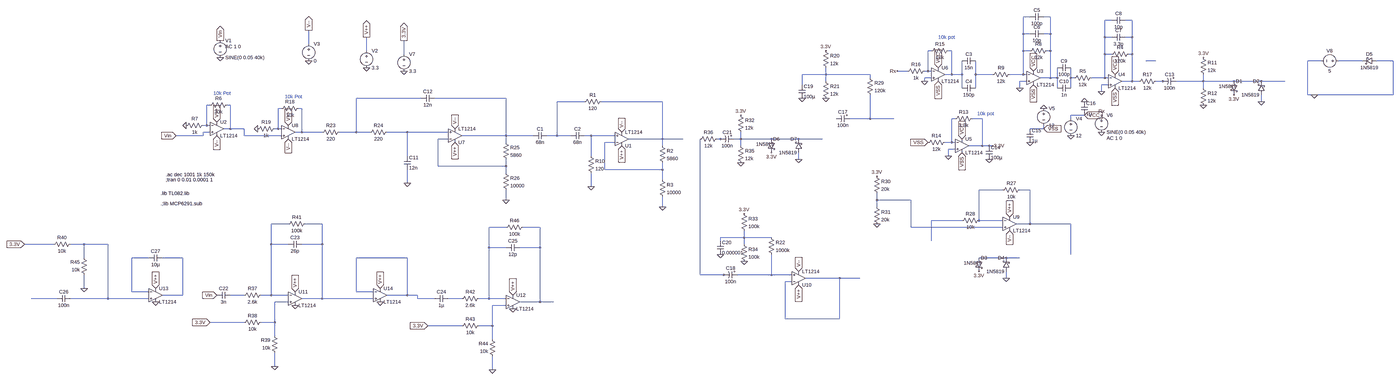
[diagram p0: schematic RxNew1.asc, whole sheet]
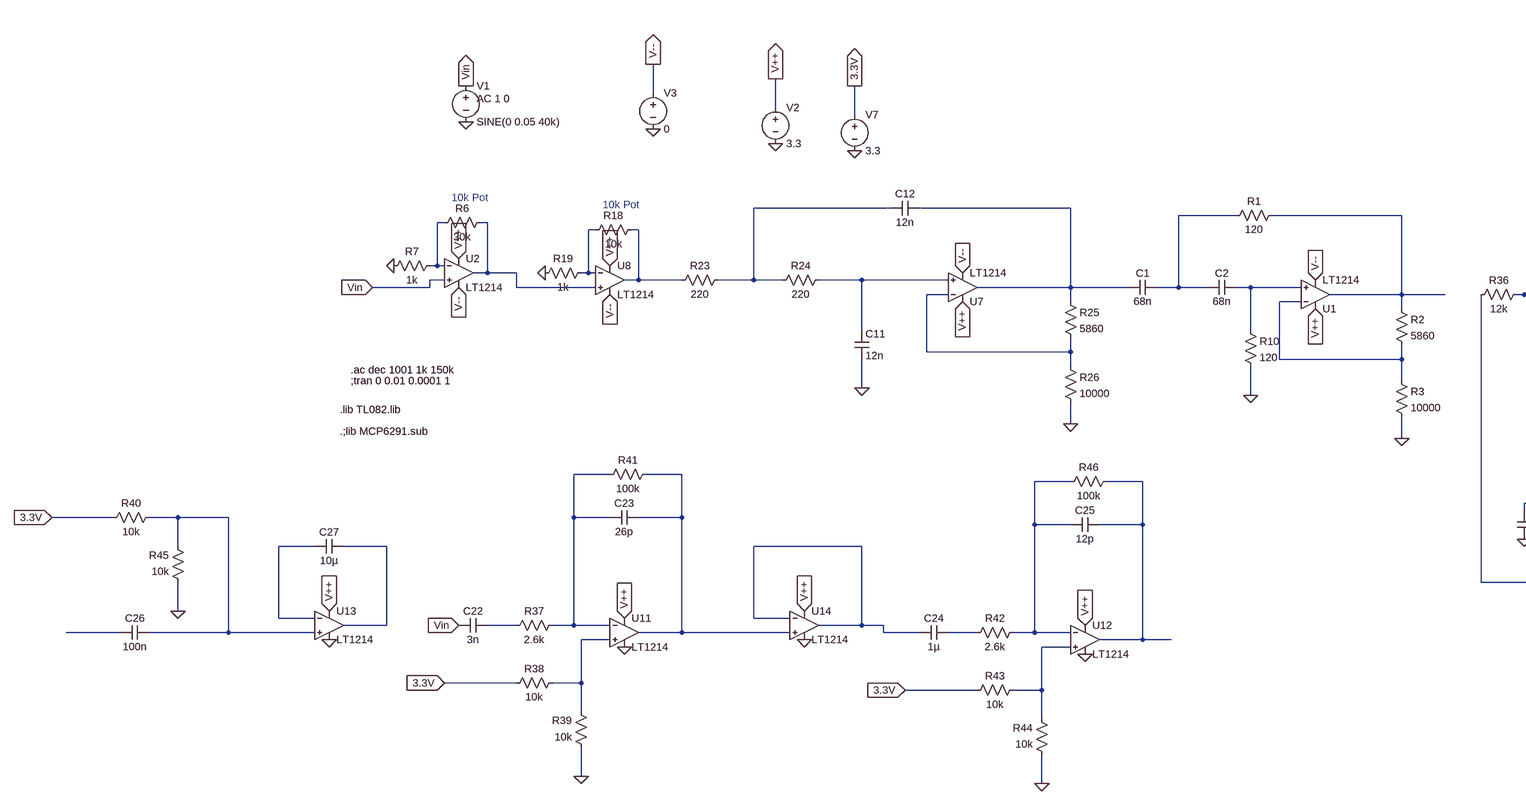
[diagram p1: schematic RxNew1.asc, part, row 1 of 1, column 1 of 2]
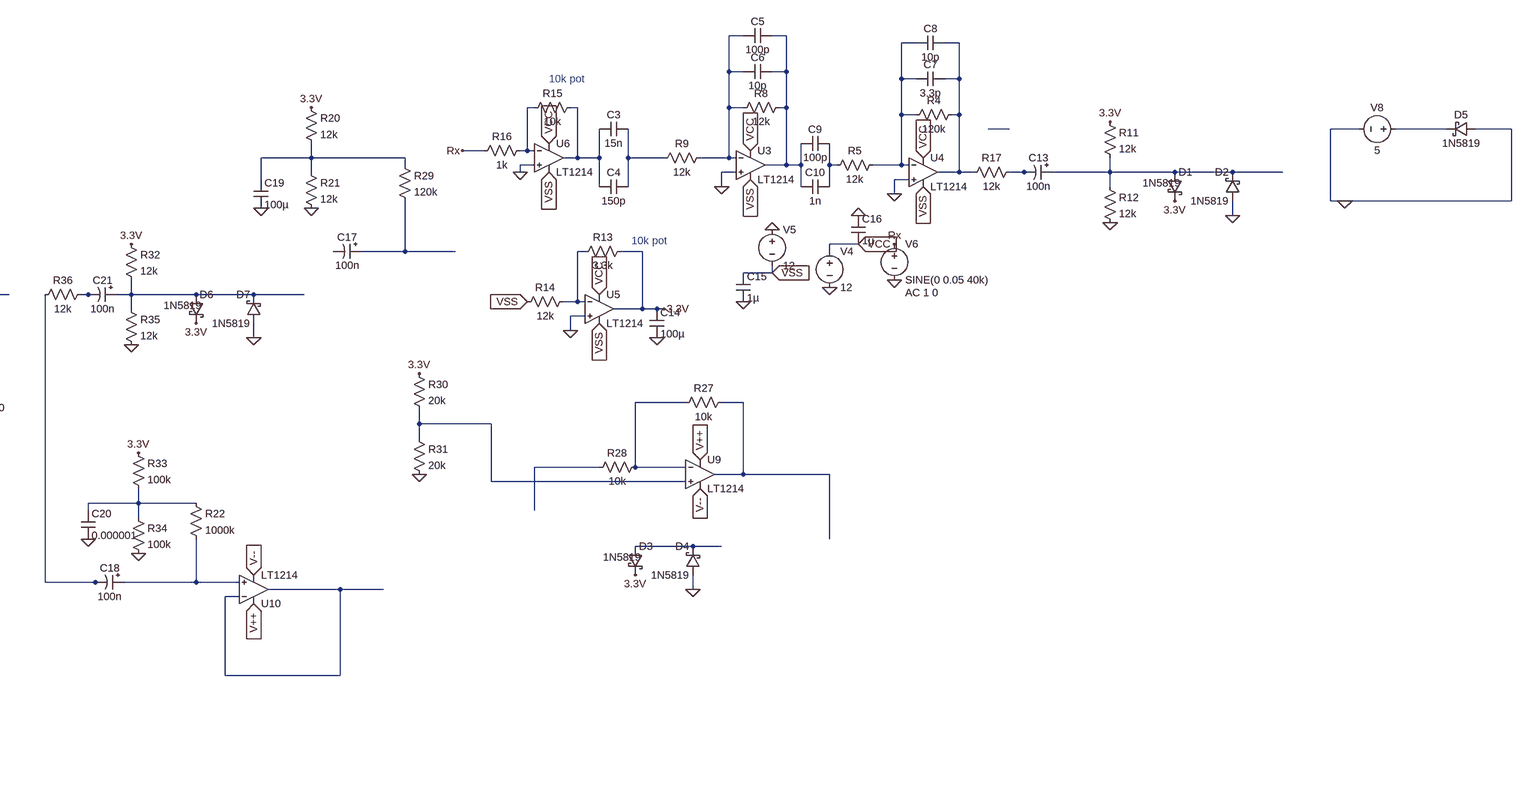
[diagram p2: schematic RxNew1.asc, part, row 1 of 1, column 2 of 2]
RxNew1.asc, the LTspice schematic file:
Version 4
SHEET 1 6372 1284
WIRE 4352 -400 4320 -400
WIRE 4448 -400 4416 -400
WIRE 4736 -384 4704 -384
WIRE 4832 -384 4800 -384
WIRE 4320 -320 4320 -400
WIRE 4352 -320 4320 -320
WIRE 4448 -320 4448 -400
WIRE 4448 -320 4416 -320
WIRE 4704 -304 4704 -384
WIRE 4736 -304 4704 -304
WIRE 4832 -304 4832 -384
WIRE 4832 -304 4800 -304
WIRE 960 -272 960 -336
WIRE 1232 -240 1232 -304
WIRE 3888 -240 3872 -240
WIRE 3984 -240 3968 -240
WIRE 4320 -240 4320 -320
WIRE 4352 -240 4320 -240
WIRE 4448 -240 4448 -320
WIRE 4448 -240 4432 -240
WIRE 1408 -224 1408 -288
WIRE 4704 -224 4704 -304
WIRE 4736 -224 4704 -224
WIRE 4832 -224 4832 -304
WIRE 4832 -224 4816 -224
WIRE 4944 -192 4896 -192
WIRE 6016 -192 5952 -192
WIRE 6224 -192 6096 -192
WIRE 6368 -192 6288 -192
WIRE 3776 -144 3728 -144
WIRE 3872 -144 3872 -240
WIRE 3872 -144 3856 -144
WIRE 3888 -144 3872 -144
WIRE 3392 -128 3392 -160
WIRE 3392 -128 3280 -128
WIRE 3600 -128 3392 -128
WIRE 3984 -128 3984 -240
WIRE 3984 -128 3952 -128
WIRE 4032 -128 4032 -192
WIRE 4032 -128 3984 -128
WIRE 4096 -128 4096 -192
WIRE 4176 -128 4096 -128
WIRE 4320 -128 4320 -240
WIRE 4320 -128 4256 -128
WIRE 4336 -128 4320 -128
WIRE 3600 -112 3600 -128
WIRE 3888 -112 3856 -112
WIRE 4448 -112 4448 -240
WIRE 4448 -112 4400 -112
WIRE 4480 -112 4480 -160
WIRE 4480 -112 4448 -112
WIRE 4544 -112 4544 -160
WIRE 4560 -112 4544 -112
WIRE 4704 -112 4704 -224
WIRE 4704 -112 4640 -112
WIRE 4720 -112 4704 -112
WIRE 3392 -96 3392 -128
WIRE 3856 -96 3856 -112
WIRE 4336 -96 4304 -96
WIRE 4832 -96 4832 -224
WIRE 4832 -96 4784 -96
WIRE 4864 -96 4832 -96
WIRE 4976 -96 4944 -96
WIRE 4992 -96 4976 -96
WIRE 5344 -96 5344 -128
WIRE 5344 -96 5040 -96
WIRE 5488 -96 5344 -96
WIRE 5616 -96 5488 -96
WIRE 5728 -96 5616 -96
WIRE 3280 -80 3280 -128
WIRE 4720 -80 4688 -80
WIRE 4032 -64 4032 -128
WIRE 4096 -64 4096 -128
WIRE 4304 -64 4304 -96
WIRE 4480 -64 4480 -112
WIRE 4544 -64 4544 -112
WIRE 5344 -64 5344 -96
WIRE 4688 -48 4688 -80
WIRE 5952 -32 5952 -192
WIRE 5984 -32 5952 -32
WIRE 6368 -32 6368 -192
WIRE 6368 -32 5984 -32
WIRE 1488 -16 1184 -16
WIRE 1888 -16 1552 -16
WIRE 2256 0 2128 0
WIRE 2624 0 2336 0
WIRE 5616 0 5616 -32
WIRE 496 16 480 16
WIRE 592 16 576 16
WIRE 832 32 816 32
WIRE 928 32 912 32
WIRE 4608 64 4544 64
WIRE 3456 80 3440 80
WIRE 3600 80 3600 -32
WIRE 3600 80 3504 80
WIRE 3712 80 3600 80
WIRE 4000 80 3984 80
WIRE 4128 80 4080 80
WIRE 4544 80 4544 64
WIRE 480 112 480 16
WIRE 480 112 464 112
WIRE 496 112 480 112
WIRE 592 128 592 16
WIRE 592 128 560 128
WIRE 656 128 592 128
WIRE 816 128 816 32
WIRE 816 128 800 128
WIRE 832 128 816 128
WIRE 4416 128 4416 112
WIRE 4416 128 4352 128
WIRE 496 144 464 144
WIRE 928 144 928 32
WIRE 928 144 896 144
WIRE 1024 144 928 144
WIRE 1184 144 1184 -16
WIRE 1184 144 1104 144
WIRE 1248 144 1184 144
WIRE 1424 144 1328 144
WIRE 1616 144 1424 144
WIRE 464 160 464 144
WIRE 464 160 336 160
WIRE 656 160 656 128
WIRE 832 160 656 160
WIRE 1888 160 1888 -16
WIRE 1888 160 1680 160
WIRE 2016 160 1888 160
WIRE 2128 160 2128 0
WIRE 2128 160 2080 160
WIRE 2192 160 2128 160
WIRE 2288 160 2256 160
WIRE 2400 160 2288 160
WIRE 1616 176 1568 176
WIRE 2624 176 2624 0
WIRE 2624 176 2464 176
WIRE 2720 176 2624 176
WIRE 2896 176 2880 176
WIRE 2912 176 2896 176
WIRE 2992 176 2992 144
WIRE 2992 176 2960 176
WIRE 3136 176 2992 176
WIRE 3264 176 3136 176
WIRE 3376 176 3264 176
WIRE 1888 192 1888 160
WIRE 2400 192 2352 192
WIRE 3984 192 3984 80
WIRE 3984 192 3952 192
WIRE 4000 192 3984 192
WIRE 2624 208 2624 176
WIRE 2992 208 2992 176
WIRE 4128 208 4128 80
WIRE 4128 208 4064 208
WIRE 4160 208 4128 208
WIRE 4176 208 4160 208
WIRE 4000 224 3968 224
WIRE 1424 256 1424 144
WIRE 2288 256 2288 160
WIRE 3968 256 3968 224
WIRE 3264 272 3264 240
WIRE 1568 304 1568 176
WIRE 1888 304 1888 272
WIRE 1888 304 1568 304
WIRE 2352 320 2352 192
WIRE 2624 320 2624 288
WIRE 2624 320 2352 320
WIRE 1888 336 1888 304
WIRE 2624 368 2624 320
WIRE 1424 384 1424 320
WIRE 2288 400 2288 336
WIRE 4224 416 4112 416
WIRE 4352 416 4304 416
WIRE 1888 464 1888 416
WIRE 3632 464 3632 432
WIRE 3792 464 3632 464
WIRE 2624 496 2624 448
WIRE 3632 496 3632 464
WIRE 4032 560 3888 560
WIRE 4112 560 4112 416
WIRE 4224 560 4112 560
WIRE 864 576 784 576
WIRE 1024 576 944 576
WIRE 4352 576 4352 416
WIRE 4352 576 4288 576
WIRE 4544 576 4352 576
WIRE 1888 592 1808 592
WIRE 2048 592 1968 592
WIRE 3792 592 3792 464
WIRE 4224 592 3792 592
WIRE 3008 640 3008 608
WIRE 3008 640 2896 640
WIRE 3136 640 3008 640
WIRE 2896 656 2896 640
WIRE 3888 656 3888 560
WIRE -240 672 -400 672
WIRE -96 672 -160 672
WIRE 16 672 -96 672
WIRE 784 672 784 576
WIRE 864 672 784 672
WIRE 1024 672 1024 576
WIRE 1024 672 928 672
WIRE 3008 672 3008 640
WIRE 1808 688 1808 592
WIRE 1888 688 1808 688
WIRE 2048 688 2048 592
WIRE 2048 688 1952 688
WIRE 4544 720 4544 576
WIRE -96 736 -96 672
WIRE 208 736 128 736
WIRE 368 736 272 736
WIRE 1424 736 1184 736
WIRE 4240 736 4112 736
WIRE 4304 736 4240 736
WIRE 2800 816 2800 176
WIRE 2912 816 2800 816
WIRE 2928 816 2912 816
WIRE 3136 816 3136 720
WIRE 3136 816 2976 816
WIRE 3232 816 3136 816
WIRE 3456 832 3296 832
WIRE 3552 832 3456 832
WIRE 4240 832 4240 800
WIRE 3232 848 3200 848
WIRE -96 880 -96 816
WIRE 128 896 128 736
WIRE 208 896 128 896
WIRE 1184 896 1184 736
WIRE 1264 896 1184 896
WIRE 368 912 368 736
WIRE 368 912 272 912
WIRE 656 912 592 912
WIRE 784 912 784 672
WIRE 784 912 736 912
WIRE 864 912 784 912
WIRE 1424 912 1424 736
WIRE 1424 912 1328 912
WIRE 1472 912 1424 912
WIRE -224 928 -368 928
WIRE 16 928 16 672
WIRE 16 928 -160 928
WIRE 208 928 16 928
WIRE 1024 928 1024 672
WIRE 1024 928 928 928
WIRE 1264 928 1024 928
WIRE 1472 928 1472 912
WIRE 1552 928 1472 928
WIRE 1680 928 1616 928
WIRE 1808 928 1808 688
WIRE 1808 928 1760 928
WIRE 1888 928 1808 928
WIRE 864 944 800 944
WIRE 2048 944 2048 688
WIRE 2048 944 1952 944
WIRE 2112 944 2048 944
WIRE 1888 960 1824 960
WIRE 3200 1024 3200 848
WIRE 3456 1024 3456 832
WIRE 3456 1024 3200 1024
WIRE 656 1040 496 1040
WIRE 800 1040 800 944
WIRE 800 1040 736 1040
WIRE 1680 1056 1520 1056
WIRE 1824 1056 1824 960
WIRE 1824 1056 1760 1056
WIRE 800 1104 800 1040
WIRE 1824 1120 1824 1056
WIRE 800 1248 800 1184
WIRE 1824 1264 1824 1200
FLAG 1232 -160 0
FLAG 960 -192 0
FLAG 1232 -304 V++
IOPIN 1232 -304 Out
FLAG 960 -336 V--
IOPIN 960 -336 Out
FLAG 544 -208 0
FLAG 544 -288 Vin
IOPIN 544 -288 Out
FLAG 384 112 0
FLAG 528 160 V--
IOPIN 528 160 In
FLAG 528 96 V++
IOPIN 528 96 In
FLAG 2432 144 V--
IOPIN 2432 144 In
FLAG 2432 208 V++
IOPIN 2432 208 In
FLAG 2624 496 0
FLAG 2288 400 0
FLAG 1424 384 0
FLAG 1648 128 V--
IOPIN 1648 128 In
FLAG 1648 192 V++
IOPIN 1648 192 In
FLAG 1888 464 0
FLAG 4688 -48 0
FLAG 4544 160 0
FLAG 4416 32 0
FLAG 4752 -128 VCC
IOPIN 4752 -128 In
FLAG 4752 -64 VSS
IOPIN 4752 -64 In
FLAG 4688 144 0
FLAG 4304 -64 0
FLAG 4368 -144 VCC
IOPIN 4368 -144 In
FLAG 4368 -80 VSS
IOPIN 4368 -80 In
FLAG 5344 16 0
FLAG 5344 -208 3.3V
FLAG 4176 208 3.3V
FLAG 3968 256 0
FLAG 4032 176 VCC
IOPIN 4032 176 In
FLAG 4032 240 VSS
IOPIN 4032 240 In
FLAG 3872 192 VSS
IOPIN 3872 192 In
FLAG 4688 64 Rx
FLAG 5616 0 0
FLAG 5488 -32 3.3V
FLAG 3856 -96 0
FLAG 3728 -144 Rx
FLAG 3920 -96 VSS
IOPIN 3920 -96 In
FLAG 3920 -160 VCC
IOPIN 3920 -160 In
FLAG 4160 272 0
FLAG 4352 192 0
FLAG 4608 0 0
FLAG 4416 128 VSS
IOPIN 4416 128 In
FLAG 4608 64 VCC
IOPIN 4608 64 In
FLAG 720 128 0
FLAG 864 176 V--
IOPIN 864 176 In
FLAG 864 112 V++
IOPIN 864 112 In
FLAG 3392 -16 0
FLAG 3392 -240 3.3V
FLAG 336 160 Vin
IOPIN 336 160 In
FLAG 4240 832 0
FLAG 4112 800 3.3V
FLAG 4256 608 V--
IOPIN 4256 608 In
FLAG 4256 544 V++
IOPIN 4256 544 In
FLAG 3632 576 0
FLAG 3632 352 3.3V
FLAG 1408 -144 0
FLAG 1408 -288 3.3V
IOPIN 1408 -288 Out
FLAG 3264 800 V--
IOPIN 3264 800 In
FLAG 3264 864 V++
IOPIN 3264 864 In
FLAG 3008 752 0
FLAG 3008 528 3.3V
FLAG 3280 -16 0
FLAG 2896 720 0
FLAG 5984 -32 0
FLAG 2992 288 0
FLAG 2992 64 3.3V
FLAG 3264 272 0
FLAG 3136 240 3.3V
FLAG 800 1248 0
FLAG 896 896 V++
IOPIN 896 896 In
FLAG 1824 1264 0
FLAG 1920 912 V++
IOPIN 1920 912 In
FLAG 1520 1056 3.3V
IOPIN 1520 1056 In
FLAG 496 1040 3.3V
IOPIN 496 1040 In
FLAG 528 912 Vin
IOPIN 528 912 In
FLAG 896 960 0
FLAG 1920 976 0
FLAG 1296 880 V++
IOPIN 1296 880 In
FLAG 1296 944 0
FLAG 240 880 V++
IOPIN 240 880 In
FLAG 240 944 0
FLAG -96 880 0
FLAG -400 672 3.3V
IOPIN -400 672 In
SYMBOL voltage 1232 -256 R0
WINDOW 123 0 0 Left 0
WINDOW 39 0 0 Left 0
SYMATTR InstName V2
SYMATTR Value 3.3
SYMBOL voltage 960 -288 R0
WINDOW 123 0 0 Left 0
WINDOW 39 0 0 Left 0
SYMATTR InstName V3
SYMATTR Value 0
SYMBOL voltage 544 -304 R0
WINDOW 123 24 44 Left 2
WINDOW 39 0 0 Left 0
SYMATTR Value2 AC 1 0
SYMATTR InstName V1
SYMATTR Value SINE(0 0.05 40k)
SYMBOL Opamps\\LT1214 528 64 R0
SYMATTR InstName U2
SYMBOL res 592 0 R90
WINDOW 0 0 56 VBottom 2
WINDOW 3 32 56 VTop 2
SYMATTR InstName R6
SYMATTR Value 30k
SYMBOL res 480 96 R90
WINDOW 0 0 56 VBottom 2
WINDOW 3 32 56 VTop 2
SYMATTR InstName R7
SYMATTR Value 1k
SYMBOL cap 2080 144 R90
WINDOW 0 0 32 VBottom 2
WINDOW 3 32 32 VTop 2
SYMATTR InstName C1
SYMATTR Value 68n
SYMBOL cap 2256 144 R90
WINDOW 0 0 32 VBottom 2
WINDOW 3 32 32 VTop 2
SYMATTR InstName C2
SYMATTR Value 68n
SYMBOL Opamps\\LT1214 2432 240 M180
SYMATTR InstName U1
SYMBOL res 2352 -16 R90
WINDOW 0 0 56 VBottom 2
WINDOW 3 32 56 VTop 2
SYMATTR InstName R1
SYMATTR Value 120
SYMBOL res 2608 192 R0
SYMATTR InstName R2
SYMATTR Value 5860
SYMBOL res 2608 352 R0
SYMATTR InstName R3
SYMATTR Value 10000
SYMBOL res 2272 240 R0
SYMATTR InstName R10
SYMATTR Value 120
SYMBOL res 1120 128 R90
WINDOW 0 0 56 VBottom 2
WINDOW 3 32 56 VTop 2
SYMATTR InstName R23
SYMATTR Value 220
SYMBOL res 1344 128 R90
WINDOW 0 0 56 VBottom 2
WINDOW 3 32 56 VTop 2
SYMATTR InstName R24
SYMATTR Value 220
SYMBOL cap 1408 256 R0
SYMATTR InstName C11
SYMATTR Value 12n
SYMBOL cap 1552 -32 R90
WINDOW 0 0 32 VBottom 2
WINDOW 3 32 32 VTop 2
SYMATTR InstName C12
SYMATTR Value 12n
SYMBOL Opamps\\LT1214 1648 224 M180
SYMATTR InstName U7
SYMBOL res 1872 176 R0
SYMATTR InstName R25
SYMATTR Value 5860
SYMBOL res 1872 320 R0
SYMATTR InstName R26
SYMATTR Value 10000
SYMBOL voltage 4544 64 R0
WINDOW 123 0 0 Left 0
WINDOW 39 0 0 Left 0
SYMATTR InstName V4
SYMATTR Value 12
SYMBOL voltage 4416 16 R0
WINDOW 123 0 0 Left 0
WINDOW 39 0 0 Left 0
SYMATTR InstName V5
SYMATTR Value 12
SYMBOL res 4832 -240 R90
WINDOW 0 0 56 VBottom 2
WINDOW 3 32 56 VTop 2
SYMATTR InstName R4
SYMATTR Value 120k
SYMBOL res 4656 -128 R90
WINDOW 0 0 56 VBottom 2
WINDOW 3 32 56 VTop 2
SYMATTR InstName R5
SYMATTR Value 12k
SYMBOL res 4448 -256 R90
WINDOW 0 0 56 VBottom 2
WINDOW 3 32 56 VTop 2
SYMATTR InstName R8
SYMATTR Value 12k
SYMBOL res 4272 -144 R90
WINDOW 0 0 56 VBottom 2
WINDOW 3 32 56 VTop 2
SYMATTR InstName R9
SYMATTR Value 12k
SYMBOL Opamps\\LT1214 4368 -176 R0
SYMATTR InstName U3
SYMBOL Opamps\\LT1214 4752 -160 R0
SYMATTR InstName U4
SYMBOL cap 4096 -208 R90
WINDOW 0 0 32 VBottom 2
WINDOW 3 32 32 VTop 2
SYMATTR InstName C3
SYMATTR Value 15n
SYMBOL cap 4096 -80 R90
WINDOW 0 0 32 VBottom 2
WINDOW 3 32 32 VTop 2
SYMATTR InstName C4
SYMATTR Value 150p
SYMBOL cap 4416 -416 R90
WINDOW 0 0 32 VBottom 2
WINDOW 3 32 32 VTop 2
SYMATTR InstName C5
SYMATTR Value 100p
SYMBOL cap 4416 -336 R90
WINDOW 0 0 32 VBottom 2
WINDOW 3 32 32 VTop 2
SYMATTR InstName C6
SYMATTR Value 10p
SYMBOL cap 4800 -320 R90
WINDOW 0 0 32 VBottom 2
WINDOW 3 32 32 VTop 2
SYMATTR InstName C7
SYMATTR Value 3.3p
SYMBOL cap 4800 -400 R90
WINDOW 0 0 32 VBottom 2
WINDOW 3 32 32 VTop 2
SYMATTR InstName C8
SYMATTR Value 10p
SYMBOL cap 4544 -176 R90
WINDOW 0 0 32 VBottom 2
WINDOW 3 32 32 VTop 2
SYMATTR InstName C9
SYMATTR Value 100p
SYMBOL cap 4544 -80 R90
WINDOW 0 0 32 VBottom 2
WINDOW 3 32 32 VTop 2
SYMATTR InstName C10
SYMATTR Value 1n
SYMBOL polcap 5040 -112 R90
WINDOW 0 0 32 VBottom 2
WINDOW 3 32 32 VTop 2
SYMATTR InstName C13
SYMATTR Value 100n
SYMBOL res 5328 -224 R0
SYMATTR InstName R11
SYMATTR Value 12k
SYMBOL res 5328 -80 R0
SYMATTR InstName R12
SYMATTR Value 12k
SYMBOL Opamps\\LT1214 4032 144 R0
SYMATTR InstName U5
SYMBOL res 4096 64 R90
WINDOW 0 0 56 VBottom 2
WINDOW 3 32 56 VTop 2
SYMATTR InstName R13
SYMATTR Value 3.3k
SYMBOL res 3968 176 R90
WINDOW 0 0 56 VBottom 2
WINDOW 3 32 56 VTop 2
SYMATTR InstName R14
SYMATTR Value 12k
SYMBOL voltage 4688 48 R0
WINDOW 123 24 124 Left 2
WINDOW 39 0 0 Left 0
SYMATTR Value2 AC 1 0
SYMATTR InstName V6
SYMATTR Value SINE(0 0.05 40k)
SYMBOL schottky 5472 -96 R0
WINDOW 3 -56 24 Left 2
SYMATTR Value 1N5819
SYMATTR InstName D1
SYMATTR Description Diode
SYMATTR Type diode
SYMBOL schottky 5632 -32 R180
WINDOW 0 24 64 Left 2
WINDOW 3 24 0 Left 2
SYMATTR InstName D2
SYMATTR Value 1N5819
SYMATTR Description Diode
SYMATTR Type diode
SYMBOL Opamps\\LT1214 3920 -192 R0
SYMATTR InstName U6
SYMBOL res 3984 -256 R90
WINDOW 0 0 56 VBottom 2
WINDOW 3 32 56 VTop 2
SYMATTR InstName R15
SYMATTR Value 10k
SYMBOL res 3872 -160 R90
WINDOW 0 0 56 VBottom 2
WINDOW 3 32 56 VTop 2
SYMATTR InstName R16
SYMATTR Value 1k
SYMBOL cap 4144 208 R0
SYMATTR InstName C14
SYMATTR Value 100µ
SYMBOL res 4960 -112 R90
WINDOW 0 0 56 VBottom 2
WINDOW 3 32 56 VTop 2
SYMATTR InstName R17
SYMATTR Value 12k
SYMBOL cap 4336 128 R0
SYMATTR InstName C15
SYMATTR Value 1µ
SYMBOL cap 4592 0 R0
SYMATTR InstName C16
SYMATTR Value 1µ
SYMBOL Opamps\\LT1214 864 80 R0
SYMATTR InstName U8
SYMBOL res 928 16 R90
WINDOW 0 0 56 VBottom 2
WINDOW 3 32 56 VTop 2
SYMATTR InstName R18
SYMATTR Value 10k
SYMBOL res 816 112 R90
WINDOW 0 0 56 VBottom 2
WINDOW 3 32 56 VTop 2
SYMATTR InstName R19
SYMATTR Value 1k
SYMBOL polcap 3504 64 R90
WINDOW 0 0 32 VBottom 2
WINDOW 3 32 32 VTop 2
SYMATTR InstName C17
SYMATTR Value 100n
SYMBOL res 3376 -256 R0
SYMATTR InstName R20
SYMATTR Value 12k
SYMBOL res 3376 -112 R0
SYMATTR InstName R21
SYMATTR Value 12k
SYMBOL schottky 4096 736 R0
WINDOW 3 -56 24 Left 2
SYMATTR Value 1N5819
SYMATTR InstName D3
SYMATTR Description Diode
SYMATTR Type diode
SYMBOL schottky 4256 800 R180
WINDOW 0 24 64 Left 2
WINDOW 3 24 0 Left 2
SYMATTR InstName D4
SYMATTR Value 1N5819
SYMATTR Description Diode
SYMATTR Type diode
SYMBOL Opamps\\LT1214 4256 512 R0
SYMATTR InstName U9
SYMBOL res 3616 336 R0
SYMATTR InstName R30
SYMATTR Value 20k
SYMBOL res 3616 480 R0
SYMATTR InstName R31
SYMATTR Value 20k
SYMBOL voltage 1408 -240 R0
WINDOW 123 0 0 Left 0
WINDOW 39 0 0 Left 0
SYMATTR InstName V7
SYMATTR Value 3.3
SYMBOL res 4320 400 R90
WINDOW 0 0 56 VBottom 2
WINDOW 3 32 56 VTop 2
SYMATTR InstName R27
SYMATTR Value 10k
SYMBOL res 4128 544 R90
WINDOW 0 0 56 VBottom 2
WINDOW 3 32 56 VTop 2
SYMATTR InstName R28
SYMATTR Value 10k
SYMBOL Opamps\\LT1214 3264 896 M180
SYMATTR InstName U10
SYMBOL polcap 2976 800 R90
WINDOW 0 0 32 VBottom 2
WINDOW 3 32 32 VTop 2
SYMATTR InstName C18
SYMATTR Value 100n
SYMBOL res 2992 512 R0
SYMATTR InstName R33
SYMATTR Value 100k
SYMBOL res 2992 656 R0
SYMATTR InstName R34
SYMATTR Value 100k
SYMBOL cap 3264 -80 R0
SYMATTR InstName C19
SYMATTR Value 100µ
SYMBOL res 3584 -128 R0
SYMATTR InstName R29
SYMATTR Value 120k
SYMBOL cap 2880 656 R0
SYMATTR InstName C20
SYMATTR Value 0.000001
SYMBOL res 3120 624 R0
SYMATTR InstName R22
SYMATTR Value 1000k
SYMBOL voltage 6112 -192 R90
WINDOW 0 -32 56 VBottom 2
WINDOW 3 32 56 VTop 2
WINDOW 123 0 0 Left 0
WINDOW 39 0 0 Left 0
SYMATTR InstName V8
SYMATTR Value 5
SYMBOL schottky 6288 -208 R90
WINDOW 0 0 32 VBottom 2
WINDOW 3 32 32 VTop 2
SYMATTR InstName D5
SYMATTR Value 1N5819
SYMATTR Description Diode
SYMATTR Type diode
SYMBOL res 2976 48 R0
SYMATTR InstName R32
SYMATTR Value 12k
SYMBOL res 2976 192 R0
SYMATTR InstName R35
SYMATTR Value 12k
SYMBOL schottky 3120 176 R0
WINDOW 3 -56 24 Left 2
SYMATTR Value 1N5819
SYMATTR InstName D6
SYMATTR Description Diode
SYMATTR Type diode
SYMBOL schottky 3280 240 R180
WINDOW 0 24 64 Left 2
WINDOW 3 24 0 Left 2
SYMATTR InstName D7
SYMATTR Value 1N5819
SYMATTR Description Diode
SYMATTR Type diode
SYMBOL polcap 2960 160 R90
WINDOW 0 0 32 VBottom 2
WINDOW 3 32 32 VTop 2
SYMATTR InstName C21
SYMATTR Value 100n
SYMBOL res 2896 160 R90
WINDOW 0 0 56 VBottom 2
WINDOW 3 32 56 VTop 2
SYMATTR InstName R36
SYMATTR Value 12k
SYMBOL cap 592 896 R90
WINDOW 0 0 32 VBottom 2
WINDOW 3 32 32 VTop 2
SYMATTR InstName C22
SYMATTR Value 3n
SYMBOL res 752 896 R90
WINDOW 0 0 56 VBottom 2
WINDOW 3 32 56 VTop 2
SYMATTR InstName R37
SYMATTR Value 2.6k
SYMBOL res 752 1024 R90
WINDOW 0 0 56 VBottom 2
WINDOW 3 32 56 VTop 2
SYMATTR InstName R38
SYMATTR Value 10k
SYMBOL res 816 1200 R180
WINDOW 0 36 76 Left 2
WINDOW 3 36 40 Left 2
SYMATTR InstName R39
SYMATTR Value 10k
SYMBOL res 960 560 R90
WINDOW 0 0 56 VBottom 2
WINDOW 3 32 56 VTop 2
SYMATTR InstName R41
SYMATTR Value 100k
SYMBOL cap 928 656 R90
WINDOW 0 0 32 VBottom 2
WINDOW 3 32 32 VTop 2
SYMATTR InstName C23
SYMATTR Value 26p
SYMBOL cap 1616 912 R90
WINDOW 0 0 32 VBottom 2
WINDOW 3 32 32 VTop 2
SYMATTR InstName C24
SYMATTR Value 1µ
SYMBOL res 1776 912 R90
WINDOW 0 0 56 VBottom 2
WINDOW 3 32 56 VTop 2
SYMATTR InstName R42
SYMATTR Value 2.6k
SYMBOL res 1776 1040 R90
WINDOW 0 0 56 VBottom 2
WINDOW 3 32 56 VTop 2
SYMATTR InstName R43
SYMATTR Value 10k
SYMBOL res 1840 1216 R180
WINDOW 0 36 76 Left 2
WINDOW 3 36 40 Left 2
SYMATTR InstName R44
SYMATTR Value 10k
SYMBOL res 1984 576 R90
WINDOW 0 0 56 VBottom 2
WINDOW 3 32 56 VTop 2
SYMATTR InstName R46
SYMATTR Value 100k
SYMBOL cap 1952 672 R90
WINDOW 0 0 32 VBottom 2
WINDOW 3 32 32 VTop 2
SYMATTR InstName C25
SYMATTR Value 12p
SYMBOL Opamps\\LT1214 896 864 R0
SYMATTR InstName U11
SYMBOL Opamps\\LT1214 1920 880 R0
SYMATTR InstName U12
SYMBOL Opamps\\LT1214 240 848 R0
SYMATTR InstName U13
SYMBOL Opamps\\LT1214 1296 848 R0
SYMATTR InstName U14
SYMBOL res -144 656 R90
WINDOW 0 0 56 VBottom 2
WINDOW 3 32 56 VTop 2
SYMATTR InstName R40
SYMATTR Value 10k
SYMBOL res -80 832 R180
WINDOW 0 36 76 Left 2
WINDOW 3 36 40 Left 2
SYMATTR InstName R45
SYMATTR Value 10k
SYMBOL cap -160 912 R90
WINDOW 0 0 32 VBottom 2
WINDOW 3 32 32 VTop 2
SYMATTR InstName C26
SYMATTR Value 100n
SYMBOL cap 272 720 R90
WINDOW 0 0 32 VBottom 2
WINDOW 3 32 32 VTop 2
SYMATTR InstName C27
SYMATTR Value 10µ
TEXT 288 344 Left 2 !.ac dec 1001 1k 150k
TEXT 512 -40 Left 2 ;10k Pot
TEXT 3920 -304 Left 2 ;10k pot
TEXT 4104 56 Left 2 ;10k pot
TEXT 848 -24 Left 2 ;10k Pot
TEXT 288 368 Left 2 !;tran 0 0.01 0.0001 1
TEXT 264 432 Left 2 !.lib TL082.lib
TEXT 264 480 Left 2 !.;lib MCP6291.sub

The netlist it stands for:
* RxNew1.asc
V2 V++ 0 3.3
V3 V-- 0 0
V1 Vin 0 SINE(0 0.05 40k) AC 1 0
XU2 Vin N018 V++ V-- N019 LT1213  ; LT1214, pins In+ In- V+ V- OUT
R6 N019 N018 30k
R7 N018 0 1k
C1 N016 N015 68n
C2 N026 N016 68n
XU1 N026 N030 V++ V-- N017 LT1213  ; LT1214, pins In+ In- V+ V- OUT
R1 N017 N016 120
R2 N017 N030 5860
R3 N030 0 10000
R10 N026 0 120
R23 N014 N021 220
R24 N025 N014 220
C11 N025 0 12n
C12 N015 N014 12n
XU7 N025 N027 V++ V-- N015 LT1213  ; LT1214, pins In+ In- V+ V- OUT
R25 N015 N027 5860
R26 N027 0 10000
V4 VCC 0 12
V5 0 VSS 12
R4 N004 N003 120k
R5 N003 N011 12k
R8 N002 N001 12k
R9 N001 N010 12k
XU3 0 N001 VCC VSS N002 LT1213  ; LT1214, pins In+ In- V+ V- OUT
XU4 0 N003 VCC VSS N004 LT1213  ; LT1214, pins In+ In- V+ V- OUT
C3 N010 N006 15n
C4 N010 N006 150p
C5 N002 N001 100p
C6 N002 N001 10p
C7 N004 N003 3.3p
C8 N004 N003 10p
C9 N011 N002 100p
C10 N011 N002 1n
C13 N013 N012 100n
R11 3.3V N013 12k
R12 N013 0 12k
XU5 0 N024 VCC VSS 3.3V LT1213  ; LT1214, pins In+ In- V+ V- OUT
R13 3.3V N024 3.3k
R14 N024 VSS 12k
V6 Rx 0 SINE(0 0.05 40k) AC 1 0
D1 N013 3.3V 1N5819
D2 0 N013 1N5819
XU6 0 N005 VCC VSS N006 LT1213  ; LT1214, pins In+ In- V+ V- OUT
R15 N006 N005 10k
R16 N005 Rx 1k
C14 3.3V 0 100µ
R17 N012 N004 12k
C15 VSS 0 1µ
C16 0 VCC 1µ
XU8 N019 N020 V++ V-- N021 LT1213  ; LT1214, pins In+ In- V+ V- OUT
R18 N021 N020 10k
R19 N020 0 1k
C17 N023 N022 100n
R20 3.3V N009 12k
R21 N009 0 12k
D3 N044 3.3V 1N5819
D4 0 N044 1N5819
XU9 N033 N031 V++ V-- N032 LT1213  ; LT1214, pins In+ In- V+ V- OUT
R30 3.3V N033 20k
R31 N033 0 20k
V7 3.3V 0 3.3
R27 N032 N031 10k
R28 N031 N034 10k
XU10 N046 N047 V++ V-- N047 LT1213  ; LT1214, pins In+ In- V+ V- OUT
C18 N046 N045 100n
R33 3.3V N039 100k
R34 N039 0 100k
C19 N009 0 100µ
R29 N009 N023 120k
C20 N039 0 0.000001
R22 N039 N046 1000k
V8 N008 0 5
D5 0 N008 1N5819
R32 3.3V N029 12k
R35 N029 0 12k
D6 N029 3.3V 1N5819
D7 0 N029 1N5819
C21 N029 N028 100n
R36 N028 N045 12k
C22 N048 Vin 3n
R37 N035 N048 2.6k
R38 N051 3.3V 10k
R39 0 N051 10k
R41 N036 N035 100k
C23 N036 N035 26p
C24 N050 N043 1µ
R42 N037 N050 2.6k
R43 N052 3.3V 10k
R44 0 N052 10k
R46 N038 N037 100k
C25 N038 N037 12p
XU11 N051 N035 V++ 0 N036 LT1213  ; LT1214, pins In+ In- V+ V- OUT
XU12 N052 N037 V++ 0 N038 LT1213  ; LT1214, pins In+ In- V+ V- OUT
XU13 N040 N041 V++ 0 N042 LT1213  ; LT1214, pins In+ In- V+ V- OUT
XU14 N036 N043 V++ 0 N043 LT1213  ; LT1214, pins In+ In- V+ V- OUT
R40 N040 3.3V 10k
R45 0 N040 10k
C26 N040 N049 100n
C27 N042 N041 10µ
.model D D
.lib standard.dio
.ac dec 1001 1k 150k
* 10k Pot
* 10k pot
* 10k pot
* 10k Pot
;tran 0 0.01 0.0001 1
.lib TL082.lib
.;lib MCP6291.sub
.lib LTC.lib
.backanno
.end